# Altium schematic sheet Altimeter.SchDoc: Altimeter
size A4; SheetNumber: 10; SheetTotal: 13
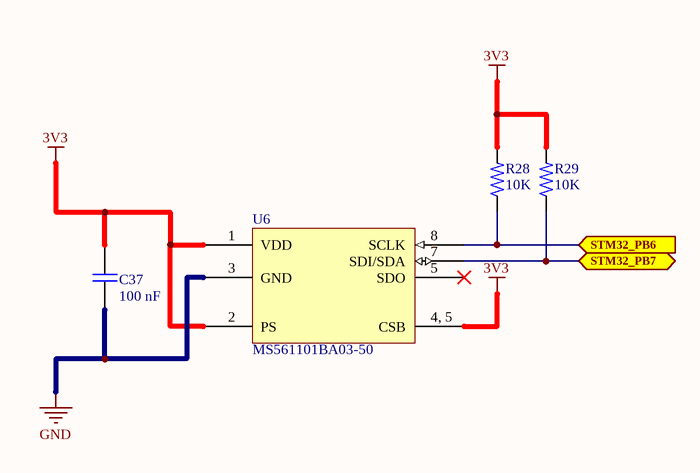
[diagram p0: Altimeter.SchDoc]

## Parts
C37  100 nF  [MergenElektronik_Capacitors_Ceramics_SMDs_0603_M_NS]
R28  10K  [MergenElektronik_Resistors_ChipResistors_0603_M_NS]
R29  10K  [MergenElektronik_Resistors_ChipResistors_0603_M_NS]
U6  MS561101BA03-50  [MergenElektronik_Sensors_AltimeterSensors_MS561101BA03-50]

## Ports
STM32_PB6 (in, see GPS[3B], Gyro[4B], Microcontroller[2C], PressureandTemperature[3B]), STM32_PB7 (bidir, see GPS[3B], Gyro[4C], Microcontroller[2C], PressureandTemperature[3B])

## Nets
3V3: C37.1 R28.2 R29.2 U6.1(VDD) U6.2(PS) U6.4,_5(CSB)
GND: C37.2 U6.3(GND)
STM32_PB6: R28.1 U6.8(SCLK) ; port STM32_PB6
STM32_PB7: R29.1 U6.7(SDI/SDA) ; port STM32_PB7

Not connected (* = marked no-connect by the designer): U6 5(SDO)*

## Notes on the sheet
- Title:
- Size:
- Date:
- A4
- Number:
- Time:
- Revision:
- Sheet
- of
- Project
- Drawn By :

## Library data of the parts
C37 = MergenElektronik_Capacitors_Ceramic_SMDs_100nF_100V: Mergen Elektronik - Capacitors - Ceramics - SMDs - 0603 - 100 nF - 100V; Manufacturer: Samsung Electro-Mechanics; Manufacturer Number: CL10B104KC8NNNC; Model: Ceramic Capacitors; Tolerance: ±10%; Value: 100 nF; Temperature: -55°C up to +125°C; Digi-Key Number: 1276-6807-1-ND; Package: 0603(1608 Metric); Mouser Number: 187-CL10B104KC8NNNC; Mounting Type: Surface Mount; Farnell Number: 3013412; Özdisan Number: CL10B104KC8NNNC; Supplier 1: Digikey; Supplier 2: Mouser; Supplier Part Number 1: 1276-6807-1-ND; Supplier Part Number 2: 187-CL10B104KC8NNNC; Voltage Rating: 100V
R28 R29 = MergenElektronik_Resistors_ChipResistors_0603_10K: Mergen Elektronik - Resistors - Chip Resistors - 0603 - 10K; Manufacturer: Stackpole Electronics Inc; Manufacturer Number: RMCF0603JT10K0; Value: Chip Resistor - 0603 - 10K; Power: 1/10W; Tolerance: ±5%; Package: 0603(1608); Temperature: -55°C up to +155°C - X8R; Model: Chip Resistor; Digi-Key Number: RMCF0603JT10K0CT-ND; Mounting Type: Surface Mount; Supplier 1: Digi-Key; Supplier Part Number 1: RMCF0603JT10K0-ND
U6 = MergenElektronik_Sensors_AltimeterSensors_MS561101BA03-50: Mergen Elektronik - Sensors - Altimeter Sensors - MS561101BA03-50; Manufacturer: TE Connectivity Measurement Specialties; Operating Supply Voltage: 1.8V up to 3.6V; Output Type: I2C, SPI; Operating Pressure: 0.15PSI up to 17.4PSI (1kPa up to 120kPa); Tolerance: ±0.022PSI (±0.15kPa); Value: MS561101BA03-50; Model: Altimeter Sensor; Temperature: -40°C up to 85°C; Mounting Type: Surface Mount; Package: MS561101BA03-50; Digi-Key Number: 223-1622-2-NDv; Mouser Number: 824-MS561101BA03-50; Farnell Number: 2362662; Özdisan Number: MS561101BA03-50; Supplier 1: Digi-Key; Supplier Part Number 1: 223-1622-2-NDv; Supplier 2: Mouser; Supplier Part Number 2: 824-MS561101BA03-50; Manufacturer Number: MS561101BA03-50